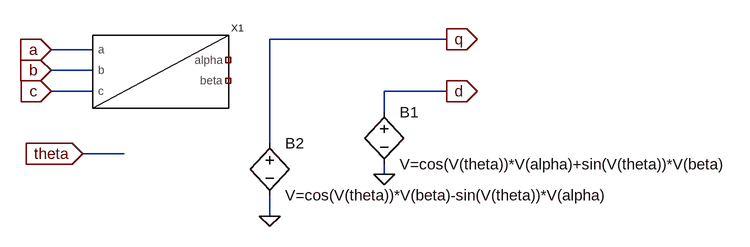
[diagram p0: schematic abctodq2.asc]
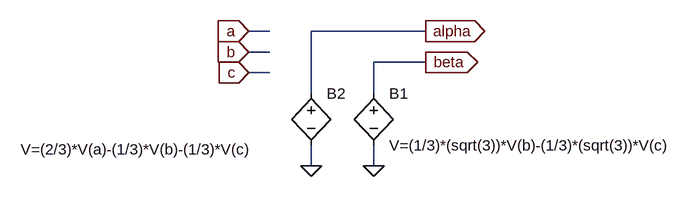
[diagram p1: sub-circuit abc_to_alphabeta.asc]
abctodq2.asc, the LTspice schematic file:
Version 4
SHEET 1 1068 680
WIRE 560 64 288 64
WIRE 16 80 -48 80
WIRE 16 112 -48 112
WIRE 16 144 -48 144
WIRE 560 144 464 144
WIRE 464 176 464 144
WIRE 288 224 288 64
WIRE 64 240 0 240
WIRE 464 272 464 256
WIRE 288 336 288 304
FLAG -48 80 a
IOPIN -48 80 In
FLAG -48 112 b
IOPIN -48 112 In
FLAG -48 144 c
IOPIN -48 144 In
FLAG 560 144 d
IOPIN 560 144 Out
FLAG 560 64 q
IOPIN 560 64 Out
FLAG 464 272 0
FLAG 288 336 0
FLAG 0 240 theta
IOPIN 0 240 In
SYMBOL abc_to_alphabeta 80 112 R0
SYMATTR InstName X1
SYMBOL bv 464 160 R0
SYMATTR InstName B1
SYMATTR Value V=cos(V(theta))*V(alpha)+sin(V(theta))*V(beta)
SYMBOL bv 288 208 R0
SYMATTR InstName B2
SYMATTR Value V=cos(V(theta))*V(beta)-sin(V(theta))*V(alpha)

abc_to_alphabeta.asc, the sub-circuit schematic file:
Version 4
SHEET 1 880 680
WIRE 32 96 0 96
WIRE 272 96 96 96
WIRE 32 128 0 128
WIRE 272 144 192 144
WIRE 32 160 0 160
WIRE 96 192 96 96
WIRE 192 192 192 144
WIRE 96 304 96 272
WIRE 192 304 192 272
FLAG 0 96 a
IOPIN 0 96 In
FLAG 0 128 b
IOPIN 0 128 In
FLAG 0 160 c
IOPIN 0 160 In
FLAG 272 96 alpha
IOPIN 272 96 Out
FLAG 272 144 beta
IOPIN 272 144 Out
FLAG 96 304 0
FLAG 192 304 0
SYMBOL bv 192 176 R0
SYMATTR InstName B1
SYMATTR Value V=(1/3)*(sqrt(3))*V(b)-(1/3)*(sqrt(3))*V(c)
SYMBOL bv 96 176 R0
WINDOW 3 -447 102 Left 2
SYMATTR InstName B2
SYMATTR Value V=(2/3)*V(a)-(1/3)*V(b)-(1/3)*V(c)

The netlist it stands for:
* abctodq2.asc
XX1 a b c NC_01 NC_02 abc_to_alphabeta
B1 d 0 V=cos(V(theta))*V(alpha)+sin(V(theta))*V(beta)
B2 q 0 V=cos(V(theta))*V(beta)-sin(V(theta))*V(alpha)

* block symbol definitions
.subckt abc_to_alphabeta a b c alpha beta
B1 beta 0 V=(1/3)*(sqrt(3))*V(b)-(1/3)*(sqrt(3))*V(c)
B2 alpha 0 V=(2/3)*V(a)-(1/3)*V(b)-(1/3)*V(c)
.ends abc_to_alphabeta

.backanno
.end